# EAGLE design xambi_2.0 (EAGLE 7.1.0)
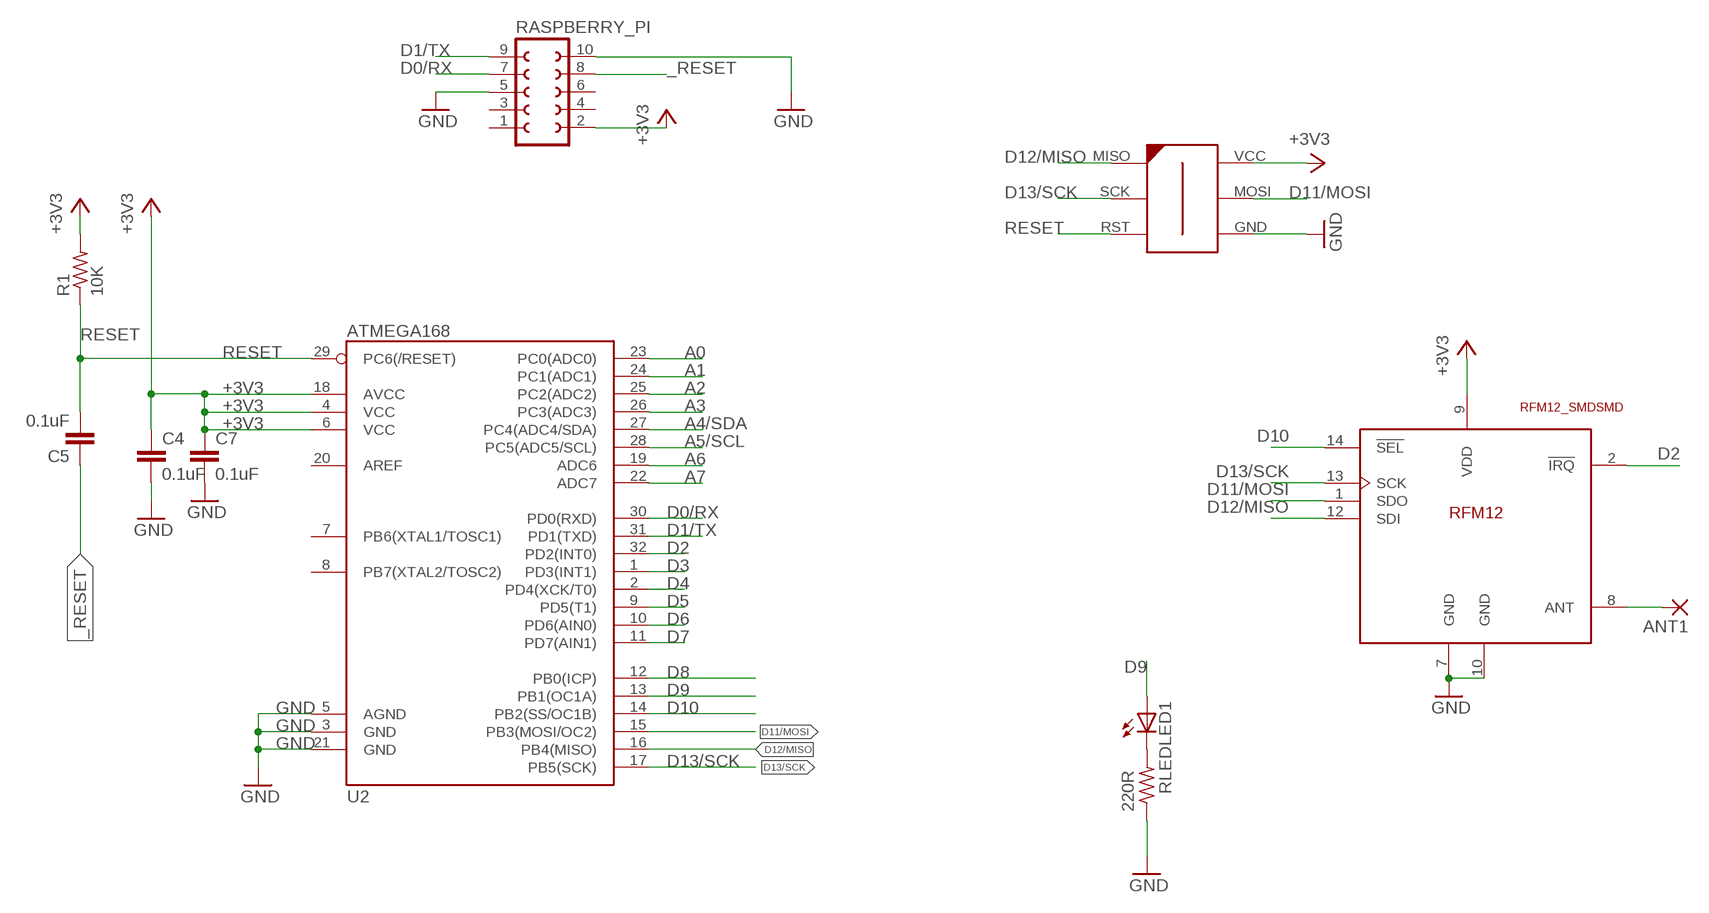
[diagram p0: schematic, sheet 1]

## Parts
ANT1  1,6/0,8  [1,6/0,8]
C4  0.1uF  C-EUC0603  [C0603]
C5  0.1uF  C-EUC0603  [C0603]
C7  0.1uF  C-EUC0603  [C0603]
ICSP  AVR-ISP-6-EDGE  [6PAD_ISP]
LED1  LEDSML0805  [SML0805]
R1  10K  R-US_R0603  [R0603]
RASPBERRY_PI  FE05-2  [FE05-2]
RLED  220R  R-US_R0805  [R0805]
U2  ATMEGA168  [TQFP32-08]
U$1  RFM12_SMDSMD  [RFM12]

## Nets
+3V3 [power]: C4.1 C7.1 ICSP.VCC R1.2 RASPBERRY_PI.2 U2.4(VCC) U2.6(VCC) U2.18(AVCC) U$1.9(VDD)
_RESET: C5.1 RASPBERRY_PI.8
A0: U2.23(PC0(ADC0))
A1: U2.24(PC1(ADC1))
A2: U2.25(PC2(ADC2))
A3: U2.26(PC3(ADC3))
A4/SDA: U2.27(PC4(ADC4/SDA))
A5/SCL: U2.28(PC5(ADC5/SCL))
A6: U2.19(ADC6)
A7: U2.22(ADC7)
D0/RX: RASPBERRY_PI.7 U2.30(PD0(RXD))
D1/TX: RASPBERRY_PI.9 U2.31(PD1(TXD))
D2: U2.32(PD2(INT0)) U$1.2(!IRQ)
D3: U2.1(PD3(INT1))
D4: U2.2(PD4(XCK/T0))
D5: U2.9(PD5(T1))
D6: U2.10(PD6(AIN0))
D7: U2.11(PD7(AIN1))
D8: U2.12(PB0(ICP))
D9: LED1.A U2.13(PB1(OC1A))
D10: U2.14(PB2(SS/OC1B)) U$1.14(!SEL)
D11/MOSI: ICSP.MOSI U2.15(PB3(MOSI/OC2)) U$1.1(SDO)
D12/MISO: ICSP.MISO U2.16(PB4(MISO)) U$1.12(SDI)
D13/SCK: ICSP.SCK U2.17(PB5(SCK)) U$1.13(SCK)
GND [power]: C4.2 C7.2 ICSP.GND RASPBERRY_PI.5 RASPBERRY_PI.10 RLED.1 U2.3(GND) U2.5(AGND) U2.21(GND) U$1.7(GND) U$1.10(GND)
N$3: LED1.C RLED.2
N$8: ANT1.1(P) U$1.8(ANT)
RESET: C5.2 ICSP.RST R1.1 U2.29(PC6(/RESET))
Unconnected: RASPBERRY_PI.1 RASPBERRY_PI.3 RASPBERRY_PI.4 RASPBERRY_PI.6 U2.7(PB6(XTAL1/TOSC1)) U2.8(PB7(XTAL2/TOSC2)) U2.20(AREF)

## Library data of the parts
ANT1 = JeeLabs:1,6/0,8: THROUGH-HOLE PAD
C4 C5 = rcl:C-EU: CAPACITOR, European symbol
C7 = resistor:C-EU: CAPACITOR, European symbol
ICSP = avr-7:AVR-ISP-6-EDGE: 6 pin edge connector for ISP with ATMEL MCUs. Developed by Craig Moates (craig at moates dot net). Library by David Blundell (blundar at gmail dot com). Often, even a 6 pin header is really inconvenient for board layout and/or production. This SMD-only header is our de-facto standard for using an edge connector for programming with the help of a 6pin/10pin to edge card adapter.
LED1 = led:LED: LED OSRAM: - CHIPLED LG R971, LG N971, LY N971, LG Q971, LY Q971, LO R971, LY R971 LH N974, LH R974 LS Q976, LO Q976, LY Q976 LO Q996 - Hyper CHIPLED LW Q18S LB Q993, LB Q99A, LB R99A - SideLED LS A670, LO A670, LY A670, LG A670, LP A670 LB A673, LV A673, LT A673, LW A673 LH A674 LY A675 LS A676, LA A676, LO A676, LY A676, LW A676 LS A679, LY A679, LG A679 - Hyper Micro SIDELED® LS Y876, LA Y876, LO Y876, LY Y876 LT Y87S - SmartLED LW L88C, LW L88S LB L89C, LB L89S, LG L890 LS L89K, LO L89K, LY L89K LS L896, LA L896, LO L896, LY L896 - TOPLED LS T670, LO T670, LY T670, LG T670, LP T670 LSG T670, LSP T670, LSY T670, LOP T670, LYG T670 LG T671, LOG T671, LSG T671 LB T673, LV T673, LT T673, LW T673 LH T674 LS T676, LA T676, LO T676, LY T676, LB T676, LH T676, LSB T676, LW T676 LB T67C, LV T67C, LT T67C, LS T67K, LO T67K, LY T67K, LW E67C LS E67B, LA E67B, LO E67B, LY E67B, LB E67C, LV E67C, LT E67C LW T67C LS T679, LY T679, LG T679 LS T770, LO T770, LY T770, LG T770, LP T770 LB T773, LV T773, LT T773, LW T773 LH T774 LS E675, LA E675, LY E675, LS T675 LS T776, LA T776, LO T776, LY T776, LB T776 LHGB T686 LT T68C, LB T68C - Hyper Mini TOPLED® LB M676 - Mini TOPLED Santana® LG M470 LS M47K, LO M47K, LY M47K Source: http://www.osram.convergy.de LUXEON: - LUMILED® LXK2-PW12-R00, LXK2-PW12-S00, LXK2-PW14-U00, LXK2-PW14-V00 LXK2-PM12-R00, LXK2-PM12-S00, LXK2-PM14-U00 LXK2-PE12-Q00, LXK2-PE12-R00, LXK2-PE12-S00, LXK2-PE14-T00, LXK2-PE14-U00 LXK2-PB12-K00, LXK2-PB12-L00, LXK2-PB12-M00, LXK2-PB14-N00, LXK2-PB14-P00, LXK2-PB14-Q00 LXK2-PR12-L00, LXK2-PR12-M00, LXK2-PR14-Q00, LXK2-PR14-R00 LXK2-PD12-Q00, LXK2-PD12-R00, LXK2-PD12-S00 LXK2-PH12-R00, LXK2-PH12-S00 LXK2-PL12-P00, LXK2-PL12-Q00, LXK2-PL12-R00 Source: www.luxeon.com KINGBRIGHT: KA-3528ASYC Source: www.kingbright.com
R1 RLED = adafruit:R-US_: RESISTOR, American symbol
RASPBERRY_PI = con-lsta:FE05-2: FEMALE HEADER; OC_FARNELL: unknown; OC_NEWARK: unknown
U2 = SparkFun:ATMEGA168
U$1 = rfm_12:RFM12_SMD: RFM12 is a low costing ISM band transceiver module implemented with unique PLL. It works signal ranges from 315/433/868/915MHZ bands, comply with FCC, ETSI regulation. The SPI interface is used to communicate with microcontroller for parameter setting.

## Net classes
0 default: width 0.254 mm, drill 0.254 mm, clearance 0.254 mm
1 power: width 0.305 mm, drill 0.305 mm, clearance 0.305 mm

## Board
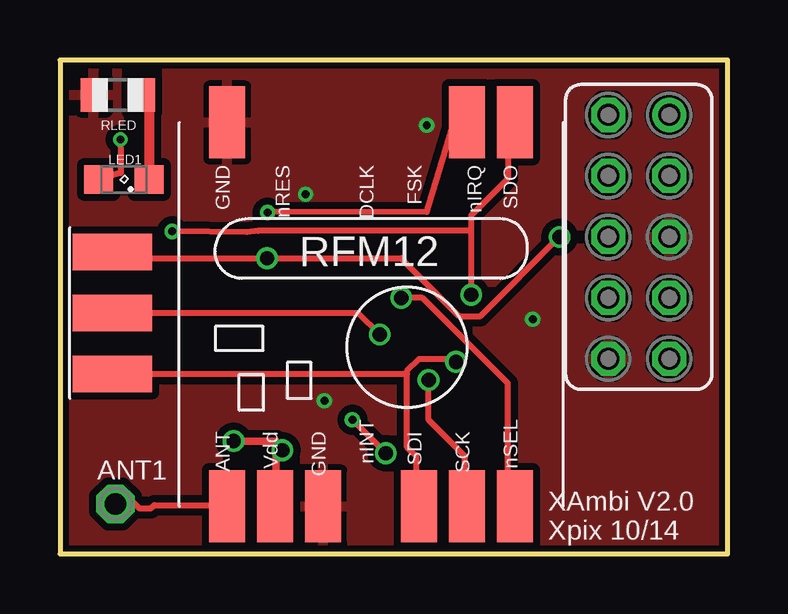
[diagram p1: board, top side]
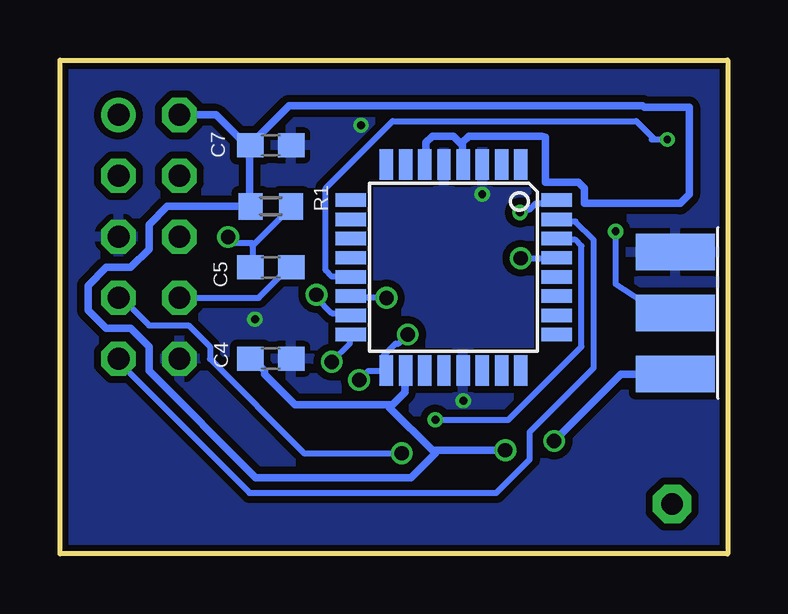
[diagram p2: board, bottom side, seen from below]

Size 27.84 x 20.58 mm. Coordinates in mm from the lower left corner, seen from the top.
Outline: 0,20.58 0,0 27.84,0 27.84,20.58 0,20.58
Copper layers (1*16): Top 0.035mm / dielectric 1.5mm / Bottom 0.035mm
Design rules "ITEADstudio_DRC": minimum track width 6mil, minimum drill 12mil, track to track 6mil, track to pad 6mil, pad to pad 6mil, via to via 6mil, smd to smd 0mil, copper to edge 10mil, drill to drill 10mil, minimum pad ring 10mil, minimum via ring 6mil, stop-mask expansion 2mil, vias tented up to drill 100mil, thermal gap 10mil

### Footprints (pad centres in the part's own frame; a part is rotated, then mirrored left to right if it is on the bottom)
1,6/0,8 = drill 0.9 pad 1.6 octagon: 1 0,0
C0603 = smd 1.1 x 1: 1 -0.85,0; 2 0.85,0
6PAD_ISP = smd 1.524 x 3.302 bottom: GND 2.54,0; MOSI 0,0; VCC -2.54,0 | smd 1.524 x 3.302: MISO -2.54,0; RST 2.54,0; SCK 0,0
SML0805 = smd 1.2 x 1.2: A 1.05,0; C -1.05,0
R0603 = smd 1 x 1.1: 1 -0.85,0; 2 0.85,0
FE05-2 = drill 0.914: 1 -5.08,1.27 | drill 0.914 octagon: 2 -5.08,-1.27; 3 -2.54,1.27; 4 -2.54,-1.27; 5 0,1.27; 6 0,-1.27; 7 2.54,1.27; 8 2.54,-1.27; 9 5.08,1.27; 10 5.08,-1.27
R0805 = smd 1.1 x 1.4: 1 -1,0; 2 1,0
TQFP32-08 = smd 1.27 x 0.559: 1 -4.293,2.8; 2 -4.293,2; 3 -4.293,1.2; 4 -4.293,0.4; 5 -4.293,-0.4; 6 -4.293,-1.2; 7 -4.293,-2; 8 -4.293,-2.8; 17 4.293,-2.8; 18 4.293,-2; 19 4.293,-1.2; 20 4.293,-0.4; 21 4.293,0.4; 22 4.293,1.2; 23 4.293,2; 24 4.293,2.8 | smd 0.559 x 1.27: 9 -2.8,-4.293; 10 -2,-4.293; 11 -1.2,-4.293; 12 -0.4,-4.293; 13 0.4,-4.293; 14 1.2,-4.293; 15 2,-4.293; 16 2.8,-4.293; 25 2.8,4.293; 26 2,4.293; 27 1.2,4.293; 28 0.4,4.293; 29 -0.4,4.293; 30 -1.2,4.293; 31 -2,4.293; 32 -2.8,4.293
RFM12 = smd 1.5 x 3: 1 -5,-10; 2 -3,-10; 7 7,-10; 8 7,6; 9 5,6; 10 3,6; 12 -1,6; 13 -3,6; 14 -5,6

### Placement (x,y rotation side)
ANT1  2.31,2.08 0 top
C4  19.05,8.13 0 bottom
C5  19.05,11.94 180 bottom
C7  19.05,17.02 0 bottom
ICSP  2.18,10.03 90 top
LED1  2.67,15.6 180 top
R1  19.05,14.48 180 bottom
RASPBERRY_PI  24.13,13.21 270 top
RLED  2.41,19.13 0 top
U2  11.43,11.94 270 bottom
U$1  13.97,7.98 180 top

### Tracks (layer width: path | path; a pad name or v marks a point on that pad's centre or on a via)
+3V3  (via drill 0.6)
  Top 0.305: U$1.9 9.02,2.03 9.02,4.06 v9.27,4.32 9.27,4.45 9.02,4.7 v7.24,4.7
  Bottom 0.305: 11.05,17.02 11.05,16.26 U2.4 | 11.05,17.02 11.43,17.4 12.32,17.4 12.57,17.14 12.57,16.26 U2.6 | C7.1 19.94,17.02 19.94,14.48 R1.2 23.37,14.48 24.13,13.72 24.13,12.7 24.89,11.94 25.91,11.94 26.67,11.18 26.67,10.16 25.91,9.4 24.89,9.4 24.13,8.64 24.13,7.62 19.68,3.18 13.21,3.18 12.19,4.19 12.19,4.32 | 11.05,17.02 11.05,17.14 10.79,17.4 7.75,17.4 7.61,17.36 7.61,15.48 6.23,15.48 5.98,15.23 5.98,14.61 1.98,14.61 1.6,14.98 1.6,18.61 3.48,18.61 3.56,18.67 18.29,18.67 19.81,17.14 C7.1 | RASPBERRY_PI.2 21.34,18.29 20.07,17.02 C7.1 | 14.1,6.22 13.97,6.22 13.46,6.73 13.46,7.62 U2.18 | 14.1,6.22 18.03,6.22 19.3,7.49 19.3,7.62 19.81,8.13 C4.1 | 12.19,4.32 12.32,4.32 14.1,6.1 14.1,6.22 | 12.19,4.32 v9.27,4.32 | ICSP.VCC 4.45,7.49 v7.24,4.7
_RESET
  Bottom 0.254: RASPBERRY_PI.8 19.56,10.67 18.29,11.94 C5.1
D0/RX  (via drill 0.33, 0.6)
  Top 0.254: v13.59,4.19 v12.19,5.59
  Bottom 0.254: v12.19,5.59 9.14,5.59 6.1,8.64 6.1,12.83 6.35,13.08 7.11,13.08 U2.30 | v13.59,4.19 17.65,4.19 21.59,8.13 21.59,8.64 22.48,9.53 24.13,9.53 25.27,10.67 RASPBERRY_PI.7
D1/TX
  Bottom 0.254: RASPBERRY_PI.9 25.4,8 19.94,2.54 9.65,2.54 8.26,3.94 8.26,5.08 5.59,7.75 5.59,13.08 6.35,13.84 7.11,13.84 U2.31
D2  (via drill 0.33)
  Top 0.254: v8.66,14.22 15.29,14.25 16.38,17.91 16.89,17.91 U$1.2
  Bottom 0.254: v8.66,14.22 8.26,14.35 8,14.61 7.75,14.61 7.62,14.73 7.24,14.73 U2.32
D9  (via drill 0.3)
  Top 0.254: v2.52,17.27 2.54,16.64 2.54,15.88 LED1.A
  Bottom 0.254: U2.13 15.75,11.56 16.51,11.56 16.76,11.81 16.76,15.24 13.97,18.03 3.81,18.03 3.11,17.34 | 3.11,17.34 3.05,17.27 | v2.52,17.27 3.18,17.27 3.11,17.34
D10  (via drill 0.6)
  Top 0.254: v14.22,10.67 15.11,10.67 18.67,7.11 18.67,2.29 18.92,2.03 U$1.14
  Bottom 0.254: v14.22,10.67 15.62,10.67 U2.14
D11/MOSI  (via drill 0.33, 0.6)
  Top 0.254: 17.14,13.46 17.14,14.1 18.67,15.62 18.67,17.65 18.92,17.91 U$1.1 | 17.14,13.46 v17.14,10.79 | v4.67,13.44 7.8,13.41 8.26,13.46 17.14,13.46
  Bottom 0.254: v17.14,10.79 17.14,10.67 16.51,10.03 15.75,10.03 U2.15 | ICSP.MOSI 2.79,10.03 4.67,11.25 v4.67,13.44
D12/MISO  (via drill 0.6)
  Top 0.254: v16.51,8 16.38,8.13 14.99,8.13 14.48,7.62 14.48,7.49 | 14.48,7.49 14.48,4.45 14.86,4.06 14.86,2.03 U$1.12 | 14.48,7.49 ICSP.MISO
  Bottom 0.254: v16.51,8 15.75,8.76 15.75,9.02 U2.16
D13/SCK  (via drill 0.6)
  Top 0.254: v15.37,7.24 15.37,5.59 16.89,4.06 16.89,2.03 U$1.13 | ICSP.SCK 12.45,10.03 v13.34,9.14
  Bottom 0.254: v15.37,7.24 14.99,7.62 14.35,7.62 U2.17 14.35,7.75 14.35,8.26 13.84,8.76 13.72,8.76 v13.34,9.14
GND  (via drill 0.33)
  other vias: 10.24,14.99 15.29,17.86 11.02,6.38 19.71,9.78
  pour Top (isolate 0): -1.14,22.1 -1.4,22.1 -1.4,-1.52 29.34,-1.52 29.34,21.97 -1.27,21.97
  pour Bottom (isolate 0): -0.51,21.84 28.83,21.84 28.83,-0.64 -0.51,-0.64
N$3
  Top 0.406: RLED.2 3.72,19.13 LED1.C
N$8
  Top 0.254: U$1.8 6.86,2.03 3.94,2.03 3.81,1.9 3.3,1.9 3.05,2.16 2.41,2.16 ANT1.1
RESET  (via drill 0.6)
  Top 0.254: ICSP.RST 2.29,12.57 2.54,12.32 v8.64,12.32 14.22,12.32 16.64,9.91 17.53,9.91 v20.83,13.21
  Bottom 0.254: 19.75,12.89 18.16,14.48 R1.1 | 19.75,12.89 19.81,12.83 19.81,11.94 C5.2 | v8.64,12.32 7.24,12.32 U2.29 | v20.83,13.21 20.57,12.95 19.81,12.95 19.75,12.89

### Text on the board
tNames: XAmbi V2.0 / Xpix 10/14